# Altium schematic sheet Test.SchDoc
size A4
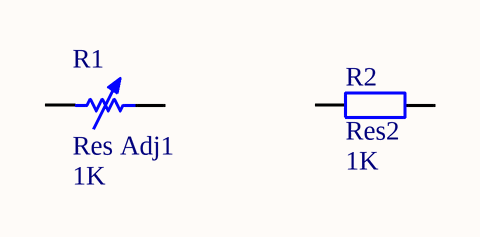
[diagram p0: Test.SchDoc]

## Parts
R1  Res Adj1  value 1K  [AXIAL-0.7]
R2  Res2  value 1K  [AXIAL-0.4]

## Nets

Not connected (* = marked no-connect by the designer): R1 1 2; R2 1 2

## Library data of the parts
R1 = Res Adj1: Variable Resistor; Set Position: 0.5; Published: 8-Jun-2000; LatestRevisionDate: 17-Jul-2002; LatestRevisionNote: Re-released for DXP Platform.; PackageReference: AXIAL-0.7; Publisher: Altium Limited; PackageDescription: Axial Device, Thru-Hole; 2 Leads; 0.7 in Pin Spacing
R2 = Res2: Resistor; Published: 8-Jun-2000; LatestRevisionDate: 17-Jul-2002; LatestRevisionNote: Re-released for DXP Platform.; PackageReference: AXIAL-0.4; Publisher: Altium Limited; PackageDescription: Axial Device, Thru-Hole; 2 Leads; 0.4 in Pin Spacing